# Altium project PW-Sat2_EPS_EM_Rbl.PrjPcb
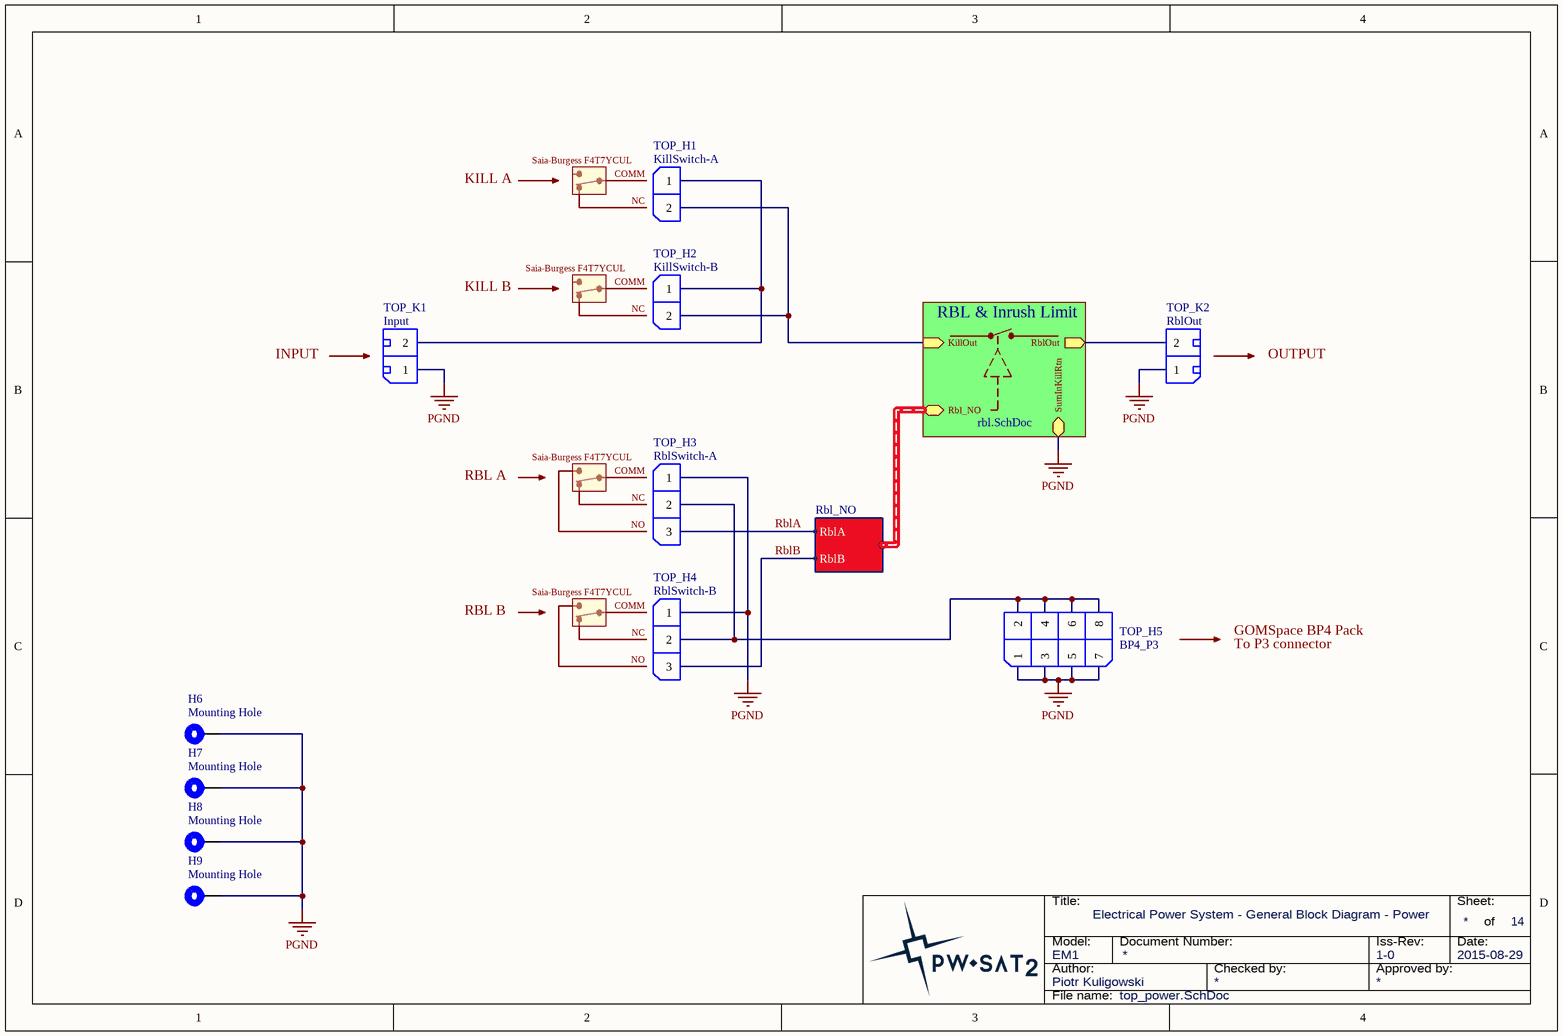
[diagram p0: top_power.SchDoc]
2 sheets, 33 parts. Net scope: hierarchical (ports join the sheet entries above them; power ports are global).
Board file: PW-Sat2_EPS_EM_Rbl.PcbDoc
Sheets:
  top_power.SchDoc
    RBL & Inrush Limit = rbl.SchDoc

## Sheet top_power.SchDoc: Electrical Power System - General Block Diagram - Power
size A4; Date: 2015-08-29; Author: Piotr Kuligowski; Revision: 1-0; SheetTotal: 14; Model: EM1; PageSetup: Record=PageOptions|CenterHorizontal=True|CenterVertical=True|PrintScale=0.52|XCorrection=1.00|YCorrection=1.00|PrintKind=1|BorderSize=5000000|LeftOffset=0|BottomOffset=0|Orientation=2|PaperLength=4200|PaperWidth=2970|Scale=100|PaperSource=7|PrintQuality=600|MediaType=1|DitherType=10|PaperKind=A3|PrintScaleMode=1

### Parts
H6  Mounting Hole  [PC-104_PcbMntHole_M3]
H7  Mounting Hole  [PC-104_PcbMntHole_M3]
H8  Mounting Hole  [PC-104_PcbMntHole_M3]
H9  Mounting Hole  [PC-104_PcbMntHole_M3]
TOP_H1  KillSwitch-A  [Harwin_Datamate_L-Tek_M80-8760205]
TOP_H2  KillSwitch-B  [Harwin_Datamate_L-Tek_M80-8760205]
TOP_H3  RblSwitch-A  [Harwin_Datamate_L-Tek_M80-8770305]
TOP_H4  RblSwitch-B  [Harwin_Datamate_L-Tek_M80-8770305]
TOP_H5  BP4_P3  [Harwin_Datamate_L-Tek_M80-8670805]
TOP_K1  ProviderPartNumber: Input  [TerminalBlock_Spring_2.54_2-R]  (hidden comment: TB-2.5-PD-xx)
TOP_K2  ProviderPartNumber: RblOut  [TerminalBlock_Spring_2.54_2-R]  (hidden comment: TB-2.5-PD-xx)

### Sub-sheets
RBL & Inrush Limit = rbl.SchDoc: RblOut (out), KillOut (in), SumInKillRtn, Rbl_NO (harness Rbl_NO)

### Harnesses
Rbl_NO: RblA, RblB

### Nets
PGND: H6.1 H7.1 H8.1 H9.1 TOP_H3.1 TOP_H4.1 TOP_H5.1 TOP_H5.3 TOP_H5.5 TOP_H5.7 TOP_K1.1 TOP_K2.1 ; sheet RBL & Inrush Limit/SumInKillRtn
RblA: TOP_H3.3 ; sheet RBL & Inrush Limit/Rbl_NO.RblA
RblB: TOP_H4.3 ; sheet RBL & Inrush Limit/Rbl_NO.RblB
NetRBL_R1_1: TOP_H1.2 TOP_H2.2 ; sheet RBL & Inrush Limit/KillOut
NetRBL_R3_1: TOP_K2.2 ; sheet RBL & Inrush Limit/RblOut
NetTOP_H1_1: TOP_H1.1 TOP_H2.1 TOP_K1.2
NetTOP_H3_2: TOP_H3.2 TOP_H4.2 TOP_H5.2 TOP_H5.4 TOP_H5.6 TOP_H5.8

### Notes on the sheet
- (near TOP_H1) Saia-Burgess F4T7YCUL
- (near TOP_H1) COMM
- KILL A
- (near TOP_H1) NC
- KILL B
- Saia-Burgess F4T7YCUL
- (near TOP_H2) COMM
- (near TOP_H2) NC
- INPUT
- OUTPUT
- RBL A
- (near TOP_H3) Saia-Burgess F4T7YCUL
- (near TOP_H3) COMM
- (near TOP_H3) NC
- (near TOP_H3) NO
- RBL B
- (near TOP_H4) COMM
- (near TOP_H4) NC
- GOMSpace BP4 Pack
- To P3 connector
- (near TOP_H4) NO
- Title:
- Sheet:
- of
- Author:
- Model:
- Document Number:
- Checked by:
- Iss-Rev:
- Approved by:
- Date:
- File name:

### Library data of the parts
H6-H9 = MntHole: PCB Mounting Hole; Value: Mounting Hole
TOP_H1 TOP_H2 = Harwin_Datamate_L-Tek_1x2pin: Harwin DataMate L-Tek, 2mm pitch, 1x2pin.; Value: Harwin DataMate L-Tek 1x2pin
TOP_H3 TOP_H4 = Harwin_Datamate_L-Tek_1x3pin: Harwin DataMate L-Tek, 2mm pitch, 1x3pin.; Value: Harwin DataMate L-Tek 1x3pin
TOP_H5 = Harwin_Datamate_L-Tek_2x4pin: Harwin DataMate L-Tek, 2mm pitch, 2x4pin.; Value: Harwin DataMate L-Tek 2x4pin
TOP_K1 TOP_K2 = TerminalBlock_Spring_2.54_2-R: Terminal block with spring, 2-pin, 2.54mm pitch, right angle.; Provider: TME.eu; Value: TB-2.5-PD-xx

## Sheet rbl.SchDoc: Remove Before Launch
size A4; Date: 2015-04-07; Author: Piotr Kuligowski; Revision: 1-0; SheetTotal: 14; Model: EM1
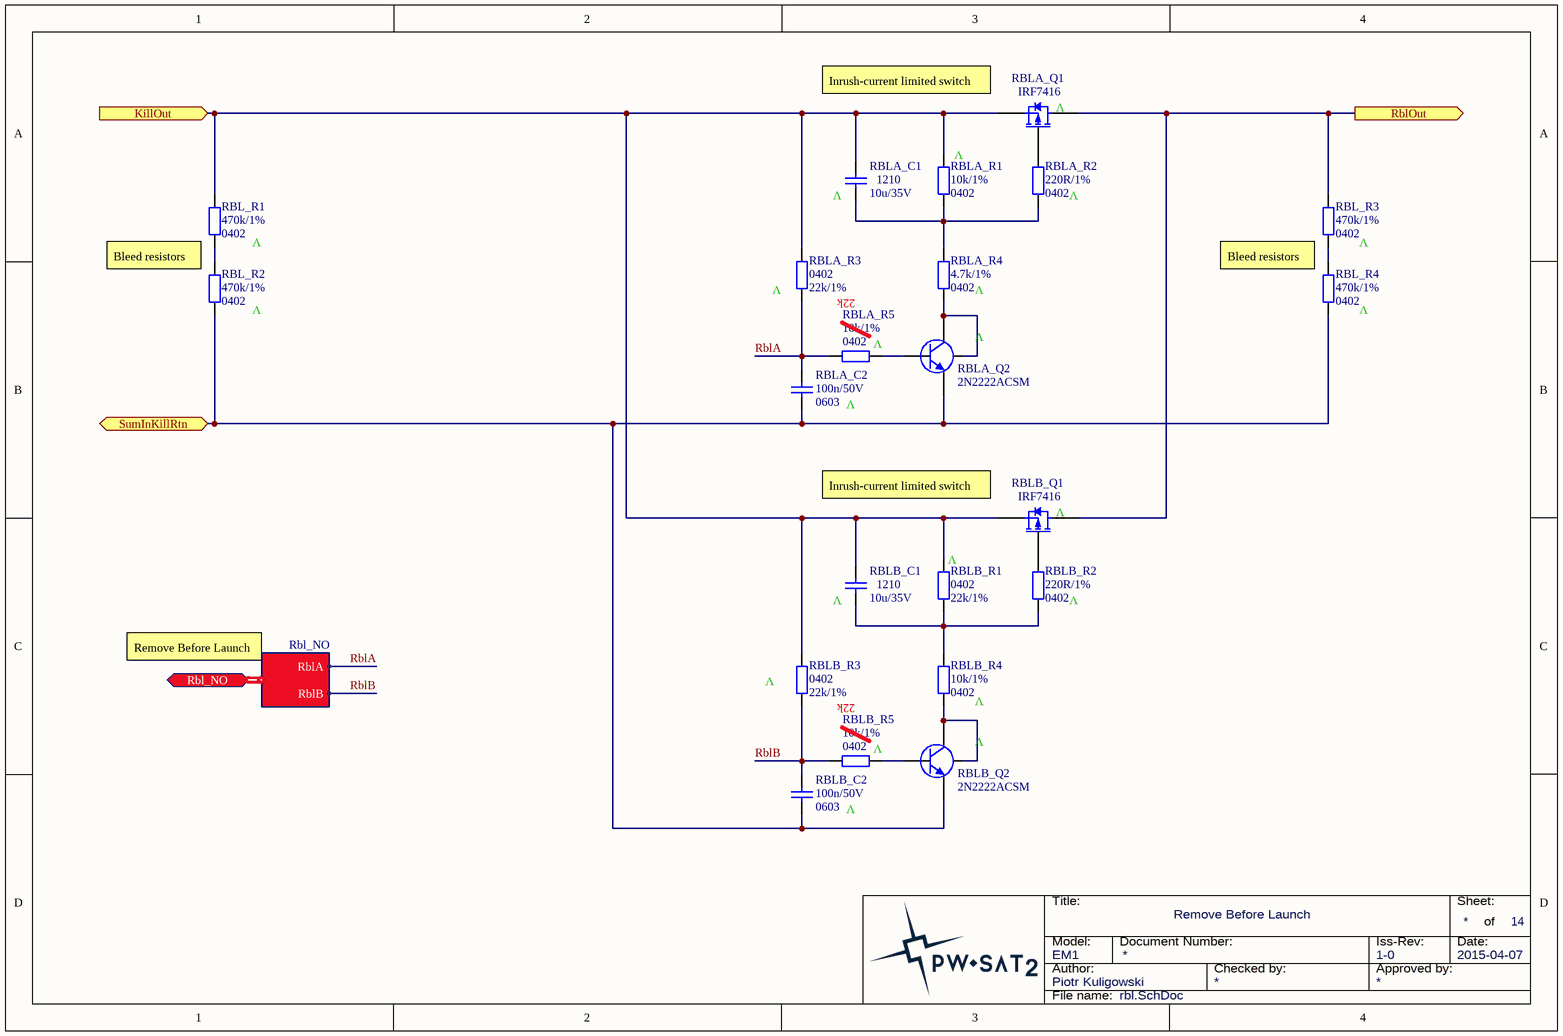
[diagram p1: rbl.SchDoc]

### Parts
RBL_R1  Package: 0402  [SMD_Resistor_0402]  (hidden comment: 470k/1%)
RBL_R2  Package: 0402  [SMD_Resistor_0402]  (hidden comment: 470k/1%)
RBL_R3  Package: 0402  [SMD_Resistor_0402]  (hidden comment: 470k/1%)
RBL_R4  Package: 0402  [SMD_Resistor_0402]  (hidden comment: 470k/1%)
RBLA_C1  Package: 1210  [SMD_Capacitor_1210]  (hidden comment: 10u/35V)
RBLA_C2  Package: 0603  [SMD_Capacitor_0603]  (hidden comment: 100n/50V)
RBLA_Q1  IRF7416  [SOIC-8-N_SSSGDDDD]
RBLA_Q2  2N2222ACSM  [LCC1-4_BEC]
RBLA_R1  Package: 0402  [SMD_Resistor_0402]  (hidden comment: 10k/1%)
RBLA_R2  Package: 0402  [SMD_Resistor_0402]  (hidden comment: 220R/1%)
RBLA_R3  Package: 0402  [SMD_Resistor_0402]  (hidden comment: 22k/1%)
RBLA_R4  Package: 0402  [SMD_Resistor_0402]  (hidden comment: 4.7k/1%)
RBLA_R5  Package: 0402  [SMD_Resistor_0402]  (hidden comment: 10k/1%)
RBLB_C1  Package: 1210  [SMD_Capacitor_1210]  (hidden comment: 10u/35V)
RBLB_C2  Package: 0603  [SMD_Capacitor_0603]  (hidden comment: 100n/50V)
RBLB_Q1  IRF7416  [SOIC-8-N_SSSGDDDD]
RBLB_Q2  2N2222ACSM  [LCC1-4_BEC]
RBLB_R1  Package: 0402  [SMD_Resistor_0402]  (hidden comment: 22k/1%)
RBLB_R2  Package: 0402  [SMD_Resistor_0402]  (hidden comment: 220R/1%)
RBLB_R3  Package: 0402  [SMD_Resistor_0402]  (hidden comment: 22k/1%)
RBLB_R4  Package: 0402  [SMD_Resistor_0402]  (hidden comment: 10k/1%)
RBLB_R5  Package: 0402  [SMD_Resistor_0402]  (hidden comment: 10k/1%)

### Ports
KillOut (in), Rbl_NO (harness Rbl_NO), RblOut (out), SumInKillRtn

### Harnesses
Rbl_NO: RblA, RblB

### Nets
PGND: RBL_R2.2 RBL_R4.2 RBLA_C2.2 RBLA_Q2.E RBLB_C2.2 RBLB_Q2.E ; port SumInKillRtn
RblA: RBLA_C2.1 RBLA_R3.2 RBLA_R5.1 ; port Rbl_NO.RblA
RblB: RBLB_C2.1 RBLB_R3.2 RBLB_R5.1 ; port Rbl_NO.RblB
NetRBL_R1_1: RBL_R1.1 RBLA_C1.1 RBLA_Q1.S RBLA_R1.1 RBLA_R3.1 RBLB_C1.1 RBLB_Q1.S RBLB_R1.1 RBLB_R3.1 ; port KillOut
NetRBL_R1_2: RBL_R1.2 RBL_R2.1
NetRBL_R3_1: RBL_R3.1 RBLA_Q1.D RBLB_Q1.D ; port RblOut
NetRBL_R3_2: RBL_R3.2 RBL_R4.1
NetRBLA_C1_2: RBLA_C1.2 RBLA_R1.2 RBLA_R2.2 RBLA_R4.1
NetRBLA_Q1_G: RBLA_Q1.G RBLA_R2.1
NetRBLA_Q2_B: RBLA_Q2.B RBLA_R5.2
NetRBLA_Q2_C: RBLA_Q2.C RBLA_Q2.Shield RBLA_R4.2
NetRBLB_C1_2: RBLB_C1.2 RBLB_R1.2 RBLB_R2.2 RBLB_R4.1
NetRBLB_Q1_G: RBLB_Q1.G RBLB_R2.1
NetRBLB_Q2_B: RBLB_Q2.B RBLB_R5.2
NetRBLB_Q2_C: RBLB_Q2.C RBLB_Q2.Shield RBLB_R4.2

### Notes on the sheet
- (near RBLA_Q1) Inrush-current limited switch
- (near RBLA_Q1) V
- (near RBLA_R1) V
- V
- (near RBLA_C1) V
- (near RBLA_R2) V
- Bleed resistors
- (near RBL_R2) V
- (near RBLA_R3) V
- 22k
- (near RBL_R4) V
- (near RBLA_R5) V
- (near RBLA_Q2) V
- (near RBLB_Q1) Inrush-current limited switch
- (near RBLB_Q1) V
- (near RBLB_R1) V
- Remove Before Launch
- (near RBLB_C1) V
- (near RBLB_R2) V
- (near RBLB_R3) V
- (near RBLB_R5) V
- (near RBLB_Q2) V
- Title:
- Sheet:
- of
- Author:
- Model:
- Document Number:
- Checked by:
- Iss-Rev:
- Approved by:
- Date:
- File name:

### Library data of the parts
RBL_R1-RBL_R4 = CRCW0402470KFKxxxx: 470k/1% Vishay CRCW 0402 Resistor. 63mW, 100ppm, 50V.; Manufacturer: Vishay; ManufacturerPartNumber: CRCW0402470KFKxxxx; Value: 470k/1%
RBLA_C1 RBLB_C1 = Cer_GCM32EC7YA106KA03K: Ceramic Cap Murata Automotive 10u/35V X7S 1210; Manufacturer: Murata; ManufacturerPartNumber: GCM32EC7YA106KA03K; Value: 10u/35V
RBLA_C2 RBLB_C2 = Cer_GCJ188R71H104KA12D: Ceramic Cap Murata Automotive 100n/50V X7R 0603; Manufacturer: Murata; ManufacturerPartNumber: GCJ188R71H104KA12D; Value: 100n/50V
RBLA_Q1 RBLB_Q1 = IRF7416: 10A/30V HEXFET Power P-MOSFET.; Manufacturer: International Rectifier; Value: IRF7416
RBLA_Q2 RBLB_Q2 = 2N2222ACSM: Silicon Planar Epitaxial NPN Transistor.; Manufacturer: Semelab-TT; Value: 2N2222ACSM
RBLA_R1 RBLA_R5 RBLB_R4 RBLB_R5 = CRCW040210K0FKxxxx: 10k/1% Vishay CRCW 0402 Resistor. 63mW, 100ppm, 50V.; Manufacturer: Vishay; ManufacturerPartNumber: CRCW040210K0FKxxxx; Value: 10k/1%
RBLA_R2 RBLB_R2 = CRCW0402220RFKxxxx: 220R/1% Vishay CRCW 0402 Resistor. 63mW, 100ppm, 50V.; Manufacturer: Vishay; ManufacturerPartNumber: CRCW0402220RFKxxxx; Value: 220R/1%
RBLA_R3 RBLB_R1 RBLB_R3 = CRCW040222K0FKxxxx: 22k/1% Vishay CRCW 0402 Resistor. 63mW, 100ppm, 50V.; Manufacturer: Vishay; ManufacturerPartNumber: CRCW040222K0FKxxxx; Value: 22k/1%
RBLA_R4 = CRCW04024K70FKxxxx: 4.7k/1% Vishay CRCW 0402 Resistor. 63mW, 100ppm, 50V.; ManufacturerPartNumber: CRCW04024K70FKxxxx; Manufacturer: Vishay; Value: 4.7k/1%

## Nets that join several sheets
PGND: top_power (12 pins), rbl (6 pins)
NetRBL_R1_1: top_power (TOP_H1.2 TOP_H2.2), rbl (9 pins)
NetRBL_R3_1: top_power (TOP_K2.2), rbl (RBL_R3.1 RBLA_Q1.D RBLB_Q1.D)
RblA: top_power (TOP_H3.3), rbl (RBLA_C2.1 RBLA_R3.2 RBLA_R5.1)
RblB: top_power (TOP_H4.3), rbl (RBLB_C2.1 RBLB_R3.2 RBLB_R5.1)